# Altium schematic sheet Input.SchDoc: Input
size A4; SheetNumber: 3; SheetTotal: 5
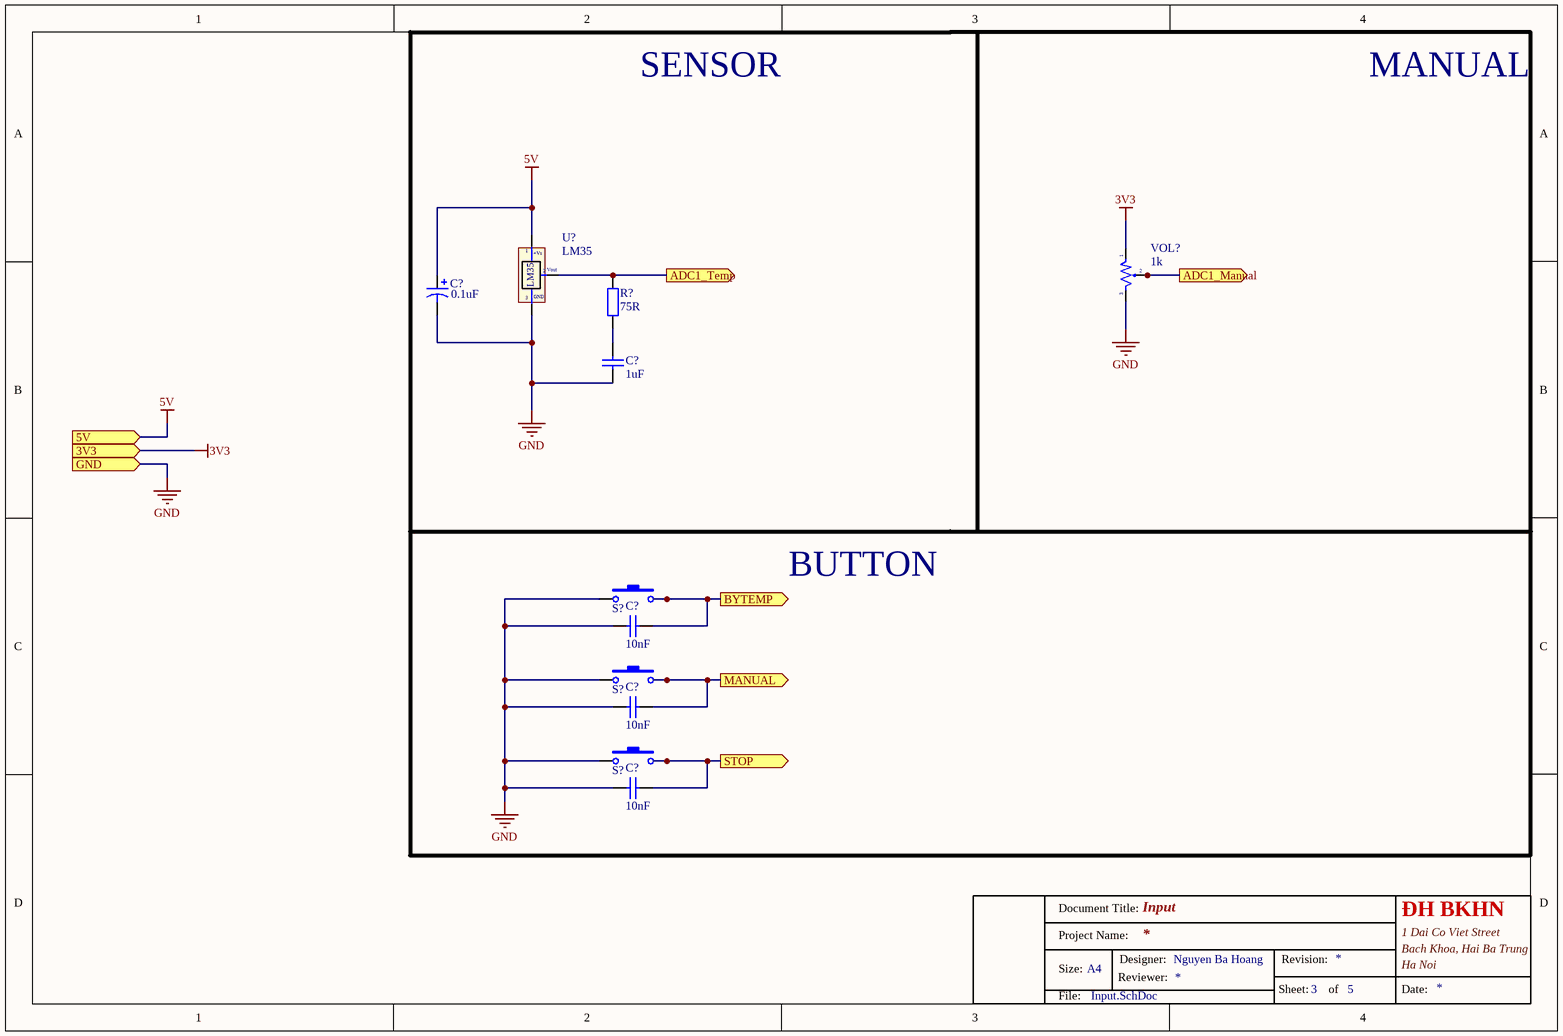
[diagram p0: Input.SchDoc]

## Parts
(Parts that share a designator on the sheet are numbered #1, #2 ... from top to bottom, then left to right.)
C?#1  0.1uF  [CAP-ALU-SMD-C]
C?#2  1uF  [CAP_0805]
C?#3  10nF  [CAP_0805]
C?#4  10nF  [CAP_0805]
C?#5  10nF  [CAP_0805]
R?  75R  [RES-SMD-0805]
S?#1  SW-SMD  [SW-SMD]  (value not drawn)
S?#2  SW-SMD  [SW-SMD]  (value not drawn)
S?#3  SW-SMD  [SW-SMD]  (value not drawn)
U?  LM35  [QTO-92]
VOL?  1k  [VOL_1]

## Ports
3V3 (in), 5V (in), ADC1_Manual (out), ADC1_Temp (out), BYTEMP (out), GND (in), MANUAL (out), STOP (out)

## Nets
3V3: VOL?.1 ; port 3V3
5V: C?#1.1 U?.1(+Vs) ; port 5V
GND: C?#1.2 C?#2.1 C?#3.1 C?#4.1 C?#5.1 S?#1.2 S?#2.2 S?#3.2 U?.3(-) VOL?.3 ; port GND
ADC1_Manual: VOL?.2 ; port ADC1_Manual
ADC1_Temp: R?.2 U?.2(Vout) ; port ADC1_Temp
BYTEMP: C?#3.2 S?#1.1 ; port BYTEMP
MANUAL: C?#4.2 S?#2.1 ; port MANUAL
STOP: C?#5.2 S?#3.1 ; port STOP
NetC?#2_2: C?#2.2 R?.1

## Notes on the sheet
- SENSOR
- MANUAL
- BUTTON
- Document Title:
- ĐH BKHN
- Project Name:
- Size:
- A4
- Reviewer:
- Designer:
- Nguyen Ba Hoang
- Revision:
- 1 Dai Co Viet Street
- Bach Khoa, Hai Ba Trung
- Ha Noi
- File:
- Sheet:
- of
- Date:
- (in symbol LM35) GND

## Library data of the parts
C?#1 = Cap Pol 5mm: Polarized Capacitor (Axial); Supplier: Thegioiic; Supplier Part Num: Tụ Nhôm SMD 0.1uF 50V 4x5.4mm
C?#2-C?#5 = CAP 102 2KV: Capacitor (Semiconductor SIM Model); Supplier: Thegioiic
  C?#2: Supplier Part Num: Tụ Gốm 0805 1uF 16V
  C?#3-C?#5: Supplier Part Num: Tụ Gốm 0805 10nF 50V
R? = R1/4W: Resistor 1/4W; Supplier: Thegioiic; Supplier Part Num: Điện Trở 75 Ohm 0805 5%
S?#1-S?#3 = SW-SMD: Switch; Supplier: Thegioiic; Supplier Part Num: Nút Nhấn 3x6mm Cao 2.5mm 2 Chân SMD Đầu Trắng
U? = LM35: Teminal; Available: *
VOL? = VOL-S: Var Resistor; Supplier: Thegioiic; Supplier Part Num: WH148-3P-102 Biến Trở Volume Đơn 1 KOhm 20% 0.125W 3 Chân